# EAGLE design Arduino_shield (EAGLE 7.7.0)
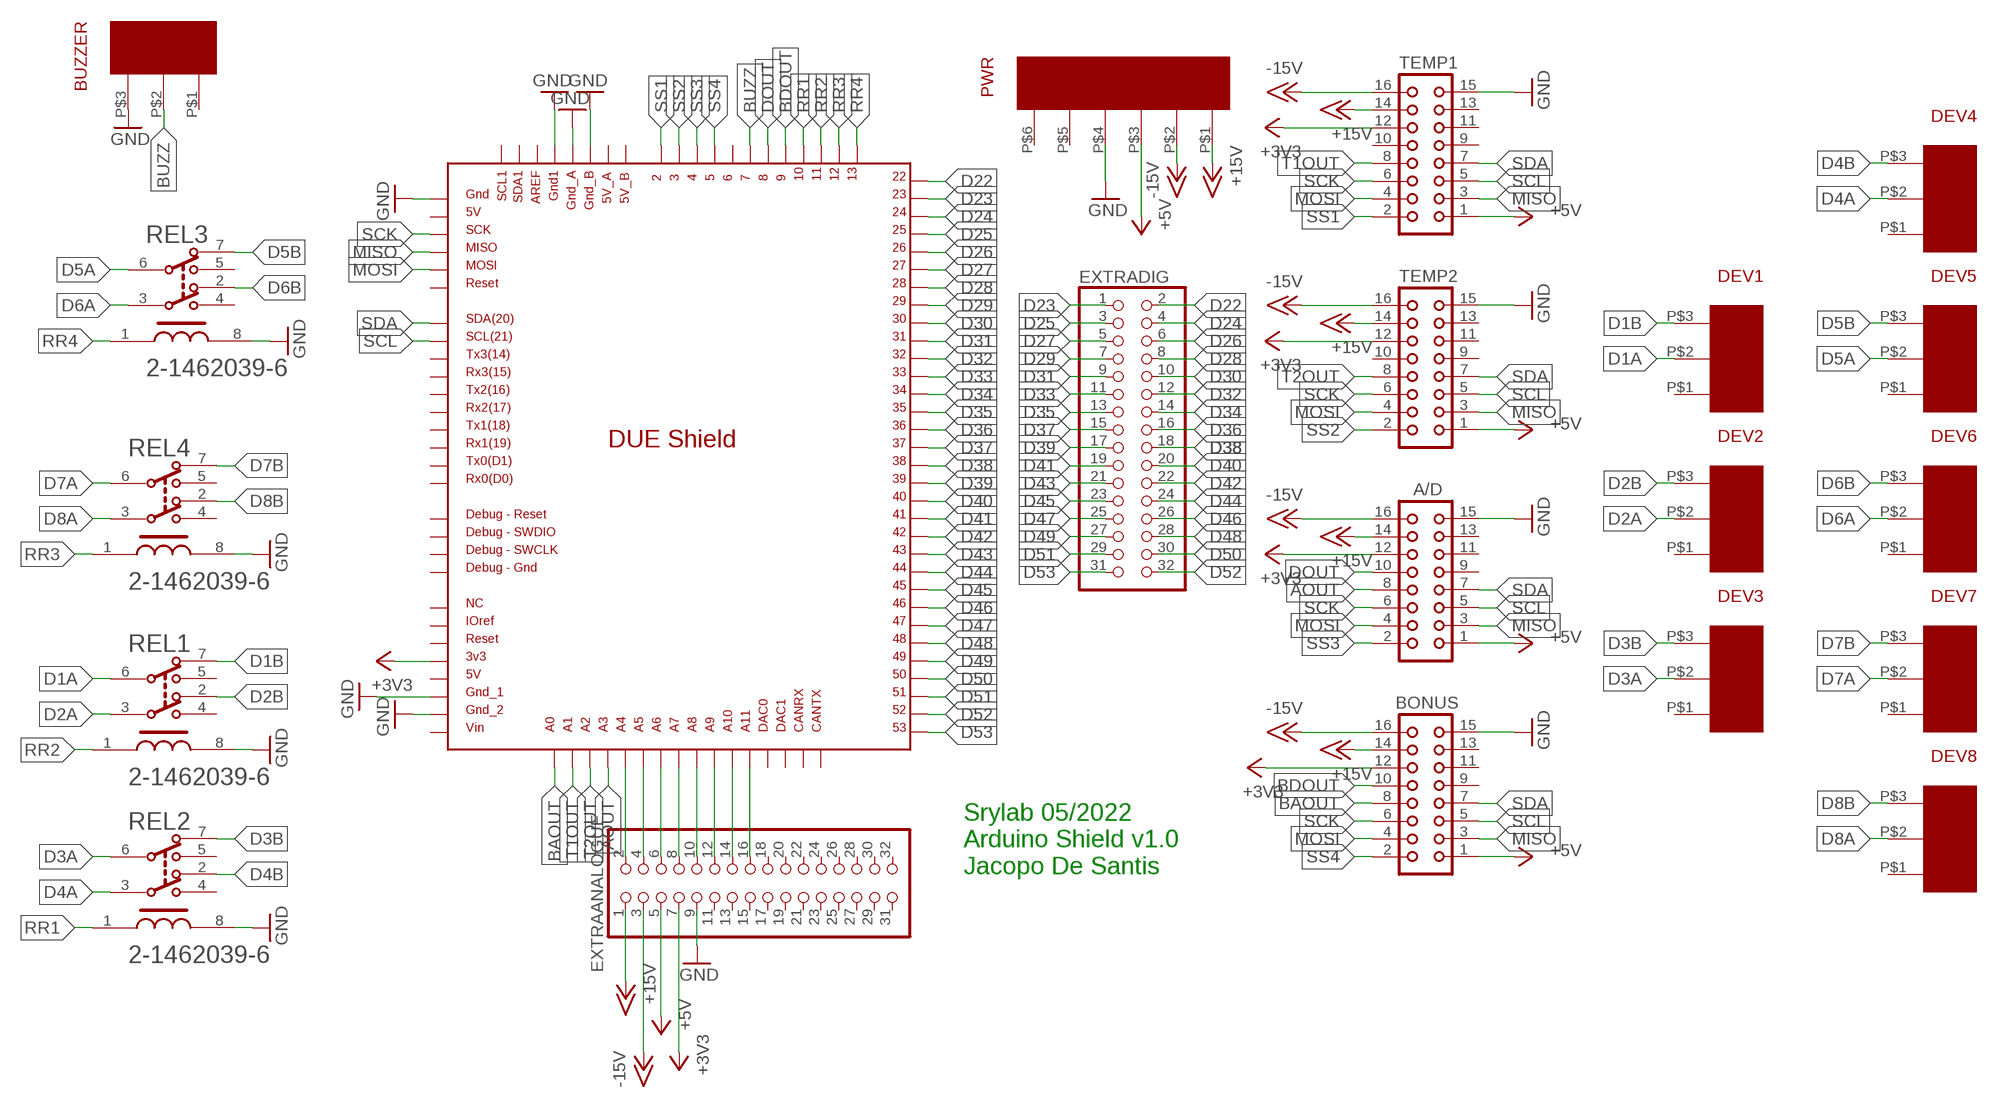
[diagram p0: schematic, sheet 1]

## Parts
A/D  CON16L  [CON16L]
BONUS  CON16L  [CON16L]
BUZZER  3PIN_CON  [3PIN_CON]
DEV1  3PIN_CON  [3PIN_CON]
DEV2  3PIN_CON  [3PIN_CON]
DEV3  3PIN_CON  [3PIN_CON]
DEV4  3PIN_CON  [3PIN_CON]
DEV5  3PIN_CON  [3PIN_CON]
DEV6  3PIN_CON  [3PIN_CON]
DEV7  3PIN_CON  [3PIN_CON]
DEV8  3PIN_CON  [3PIN_CON]
EXTRAANALOGUE  PINHD-2X16  [2X16]
EXTRADIG  PINHD-2X16  [2X16]
PWR  6PIN_CON  [6PIN_CON]
REL1  TE_2-1462039-6TE_2-1462039-6_0_0  [TE_2-1462039-6_0]
REL2  TE_2-1462039-6TE_2-1462039-6_0_0  [TE_2-1462039-6_0]
REL3  TE_2-1462039-6TE_2-1462039-6_0_0  [TE_2-1462039-6_0]
REL4  TE_2-1462039-6TE_2-1462039-6_0_0  [TE_2-1462039-6_0]
TEMP1  CON16L  [CON16L]
TEMP2  CON16L  [CON16L]
U$1  DUE(NORMAL)  [DUE(NORMAL)]

## Nets
+3V3: A/D.12 BONUS.12 EXTRAANALOGUE.7 TEMP1.12 TEMP2.12 U$1.3V3
+5V: A/D.1 BONUS.1 EXTRAANALOGUE.5 PWR.P$3 TEMP1.1 TEMP2.1
+15V: A/D.14 BONUS.14 EXTRAANALOGUE.1 PWR.P$1 TEMP1.14 TEMP2.14
-15V: A/D.16 BONUS.16 EXTRAANALOGUE.3 PWR.P$2 TEMP1.16 TEMP2.16
AOUT: A/D.8 U$1.A3
BAOUT: BONUS.8 U$1.A0
BDOUT: BONUS.10 U$1.9
BUZZ: BUZZER.P$2 U$1.7
D1A: DEV1.P$2 REL1.6
D1B: DEV1.P$3 REL1.7
D2A: DEV2.P$2 REL1.3
D2B: DEV2.P$3 REL1.2
D3A: DEV3.P$2 REL2.6
D3B: DEV3.P$3 REL2.7
D4A: DEV4.P$2 REL2.3
D4B: DEV4.P$3 REL2.2
D5A: DEV5.P$2 REL3.6
D5B: DEV5.P$3 REL3.7
D6A: DEV6.P$2 REL3.3
D6B: DEV6.P$3 REL3.2
D7A: DEV7.P$2 REL4.6
D7B: DEV7.P$3 REL4.7
D8A: DEV8.P$2 REL4.3
D8B: DEV8.P$3 REL4.2
D22: EXTRADIG.2 U$1.22
D23: EXTRADIG.1 U$1.23
D24: EXTRADIG.4 U$1.24
D25: EXTRADIG.3 U$1.25
D26: EXTRADIG.6 U$1.26
D27: EXTRADIG.5 U$1.27
D28: EXTRADIG.8 U$1.28
D29: EXTRADIG.7 U$1.29
D30: EXTRADIG.10 U$1.30
D31: EXTRADIG.9 U$1.31
D32: EXTRADIG.12 U$1.32
D33: EXTRADIG.11 U$1.33
D34: EXTRADIG.14 U$1.34
D35: EXTRADIG.13 U$1.35
D36: EXTRADIG.16 U$1.36
D37: EXTRADIG.15 U$1.37
D38: EXTRADIG.18 U$1.38
D39: EXTRADIG.17 U$1.39
D40: EXTRADIG.20 U$1.40
D41: EXTRADIG.19 U$1.41
D42: EXTRADIG.22 U$1.42
D43: EXTRADIG.21 U$1.43
D44: EXTRADIG.24 U$1.44
D45: EXTRADIG.23 U$1.45
D46: EXTRADIG.26 U$1.46
D47: EXTRADIG.25 U$1.47
D48: EXTRADIG.28 U$1.48
D49: EXTRADIG.27 U$1.49
D50: EXTRADIG.30 U$1.50
D51: EXTRADIG.29 U$1.51
D52: EXTRADIG.32 U$1.52
D53: EXTRADIG.31 U$1.53
DOUT: A/D.10 U$1.8
GND: A/D.15 BONUS.15 BUZZER.P$3 EXTRAANALOGUE.9 PWR.P$4 REL1.8 REL2.8 REL3.8 REL4.8 TEMP1.15 TEMP2.15 U$1.5V_ICSP U$1.GND1 U$1.GND_1 U$1.GND_2 U$1.GND_A U$1.GND_B
MISO: A/D.3 BONUS.3 TEMP1.3 TEMP2.3 U$1.MISO_ICSP
MOSI: A/D.4 BONUS.4 TEMP1.4 TEMP2.4 U$1.MOSI_ICSP
N$57: EXTRAANALOGUE.2 U$1.A4
N$58: EXTRAANALOGUE.4 U$1.A5
N$59: EXTRAANALOGUE.6 U$1.A6
N$60: EXTRAANALOGUE.8 U$1.A7
N$61: EXTRAANALOGUE.10 U$1.A8
N$62: EXTRAANALOGUE.12 U$1.A9
N$63: EXTRAANALOGUE.14 U$1.A10
N$64: EXTRAANALOGUE.16 U$1.A11
RR1: REL2.1 U$1.10
RR2: REL1.1 U$1.11
RR3: REL4.1 U$1.12
RR4: REL3.1 U$1.13
SCK: A/D.6 BONUS.6 TEMP1.6 TEMP2.6 U$1.SCK_ICSP
SCL: A/D.5 BONUS.5 TEMP1.5 TEMP2.5 U$1.SCL
SDA: A/D.7 BONUS.7 TEMP1.7 TEMP2.7 U$1.SDA
SS1: TEMP1.2 U$1.2
SS2: TEMP2.2 U$1.3
SS3: A/D.2 U$1.4
SS4: BONUS.2 U$1.5
T1OUT: TEMP1.8 U$1.A1
T2OUT: TEMP2.8 U$1.A2
Unconnected: A/D.9 A/D.11 A/D.13 BONUS.9 BONUS.11 BONUS.13 BUZZER.P$1 DEV1.P$1 DEV2.P$1 DEV3.P$1 DEV4.P$1 DEV5.P$1 DEV6.P$1 DEV7.P$1 DEV8.P$1 EXTRAANALOGUE.11 EXTRAANALOGUE.13 EXTRAANALOGUE.15 EXTRAANALOGUE.17 EXTRAANALOGUE.18 EXTRAANALOGUE.19 EXTRAANALOGUE.20 EXTRAANALOGUE.21 EXTRAANALOGUE.22 EXTRAANALOGUE.23 EXTRAANALOGUE.24 EXTRAANALOGUE.25 EXTRAANALOGUE.26 EXTRAANALOGUE.27 EXTRAANALOGUE.28 EXTRAANALOGUE.29 EXTRAANALOGUE.30 EXTRAANALOGUE.31 EXTRAANALOGUE.32 PWR.P$5 PWR.P$6 REL1.4 REL1.5 REL2.4 REL2.5 REL3.4 REL3.5 REL4.4 REL4.5 TEMP1.9 TEMP1.10 TEMP1.11 TEMP1.13 TEMP2.9 TEMP2.10 TEMP2.11 TEMP2.13 U$1.5V U$1.5V_A U$1.5V_B U$1.6 U$1.AREF U$1.CANRX U$1.CANTX U$1.DAC0 U$1.DAC1 U$1.GND_DEBUG U$1.GND_ICSP U$1.IOREF U$1.NC U$1.RESET U$1.RESET_DEBUG U$1.RESET_ICSP U$1.RX0 U$1.RX1 U$1.RX2 U$1.RX3 U$1.SCL1 U$1.SDA1 U$1.SWCLK_DEBUG U$1.SWDIO_DEBUG U$1.TX0 U$1.TX1 U$1.TX2 U$1.TX3 U$1.VIN

## Notes on the sheet
- Srylab 05/2022
  Arduino Shield v1.0
  Jacopo De Santis

## Library data of the parts
A/D BONUS TEMP1 TEMP2 = con-harting:CON16L: CONNECTOR; OC_FARNELL: unknown; OC_NEWARK: unknown
BUZZER DEV1-DEV8 = CoilCircuitLibrary_E7:3PIN_CON
EXTRAANALOGUE EXTRADIG = pinhead:PINHD-2X16: PIN HEADER
PWR = CoilCircuitLibrary_E7:6PIN_CON
REL1-REL4 = TE - 2-1462039-6:TE_2-1462039-6: Electromechanical Relay DPDT 2A 3VDC 180Ohm Surface Mount; AMBIENT_TEMPERATURE_RANGE_HIGH: +85°C; AMBIENT_TEMPERATURE_RANGE_LOW: -40°C; AUTOMOTIVE: No; CENTROID_NOT_SPECIFIED: No; COIL_POWER: 50mW; COIL_RESISTANCE: 180Ω; COIL_TYPE: Non-Latching; COIL_VOLTAGE: 3V; CURRENT_RATING: 2A; DATASHEET: https://www.te.com/usa-en/product-2-1462039-6.html?te_bu=Cor&te_type=other&te_campaign=oct_glo_cor-oct-global-oth-prtnr-fy19-oct-octo-buy-bom_sma-298_2&elqCampaignId=35216; DEVICE_CLASS_L1: Electromechanical; DEVICE_CLASS_L2: Relays; DEVICE_CLASS_L3: Signal Relays; DIGIKEY_DESCRIPTION: RELAY TELECOM DPDT 2A 3VDC; DIGIKEY_PART_NUMBER: PB1163CT-ND; FOOTPRINT_VARIANT_NAME_0: Recommended_Land_Pattern; HEIGHT: 5.65mm; LEAD_FREE: Yes; MF: TE; MFG_PACKAGE_IDENT: 2-1462039-6; MFG_PACKAGE_IDENT_DATE: 0; MFG_PACKAGE_IDENT_REV: 0; MOUSER_PART_NUMBER: 655-IM21GR; MPN: 2-1462039-6; NUMBER_OF_CONTACTS: 2; PACKAGE: SMT_RELAY; PREFIX: K; ROHS: Yes; STANDOFF_HEIGHT: 0.25mm; SWITCHING_CURRENT: 2A; SWITCHING_POWER: 60W; TEMPERATURE_RANGE_HIGH: +85°C; TEMPERATURE_RANGE_LOW: -40°C; THROW_CONFIGURATION: DPDT; VERIFICATION_VERSION: 0.0.0.3
U$1 = DUElib130425:DUE(NORMAL)

## Board
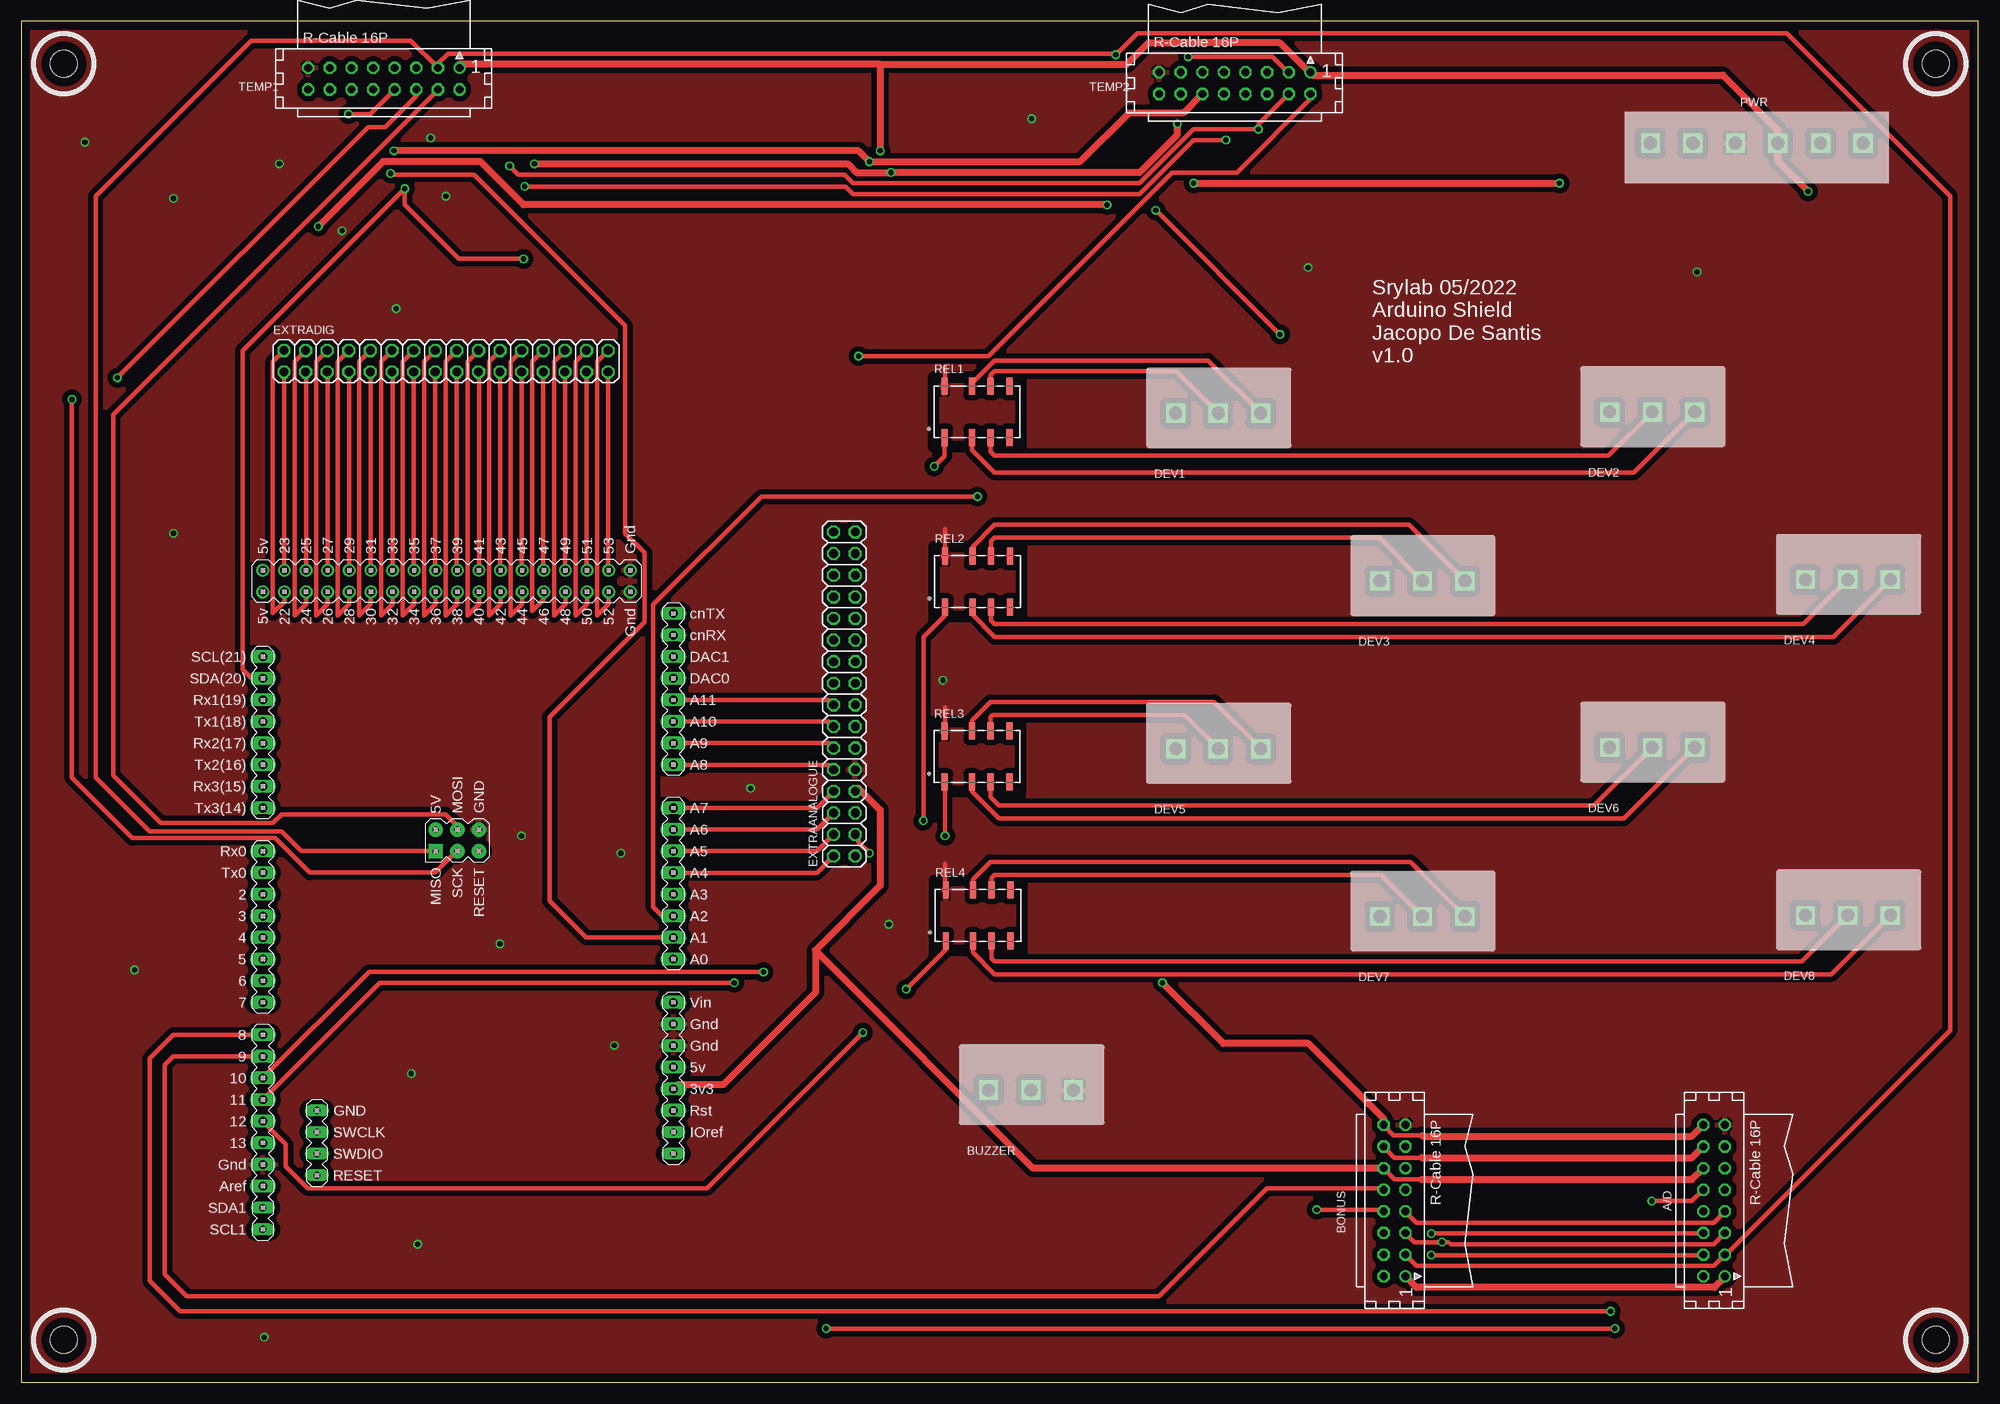
[diagram p1: board, top side]
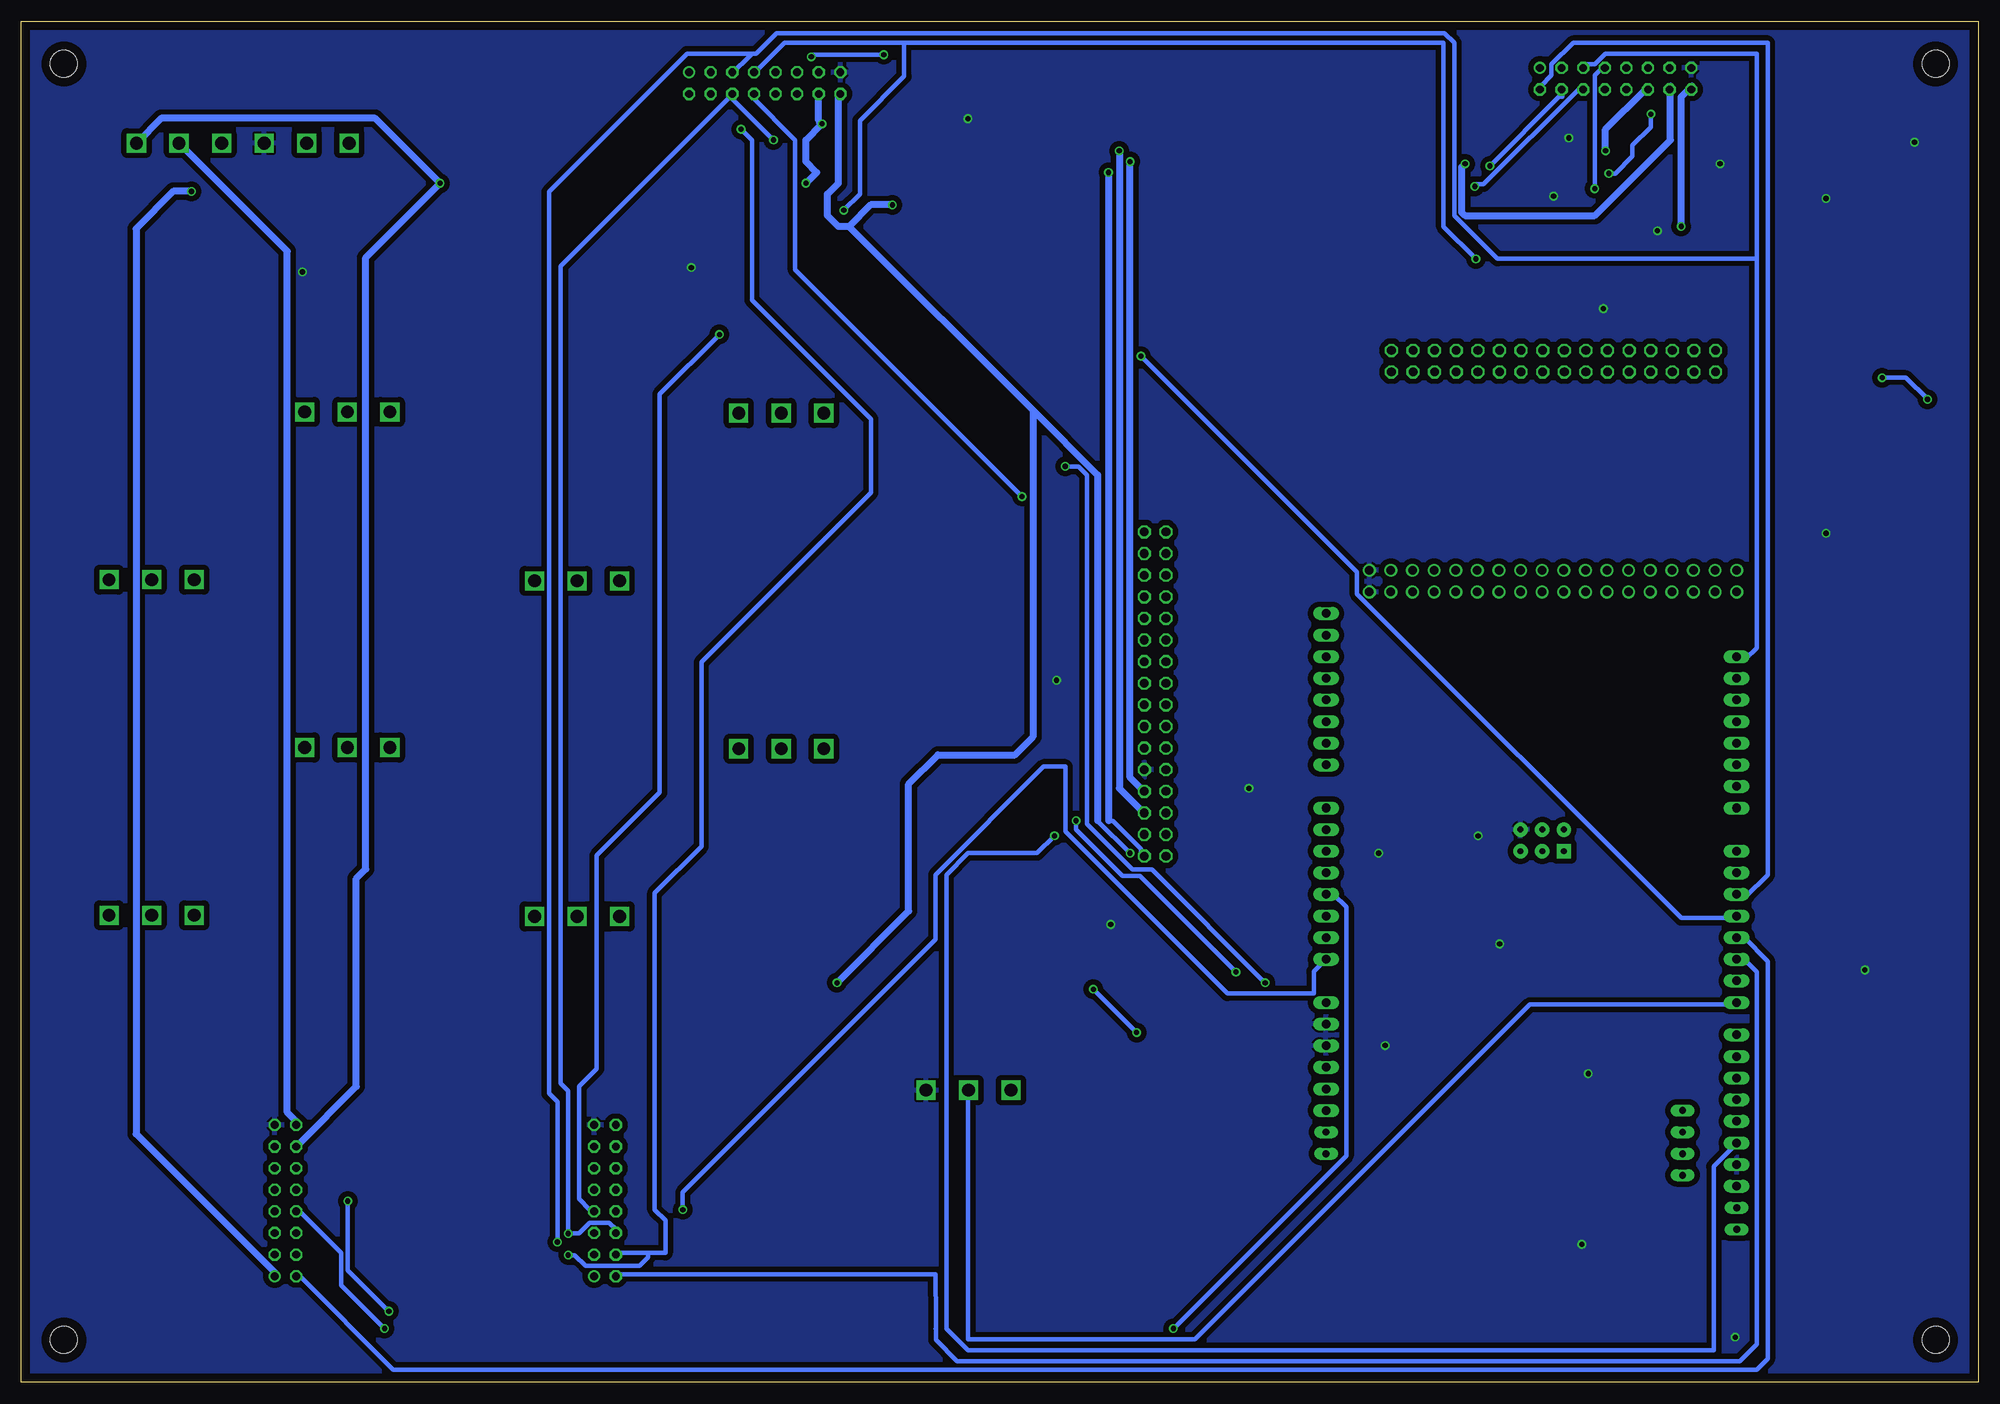
[diagram p2: board, bottom side, seen from below]

Size 230 x 160 mm. Coordinates in mm from the lower left corner, seen from the top.
Outline: 0,0 230,0 230,160 0,160 0,0
Copper layers (1*16): Top 0.035mm / dielectric 1.5mm / Bottom 0.035mm
Design rules "default *": minimum track width 10mil, minimum drill 24mil, track to track 6mil, track to pad 6mil, pad to pad 6mil, via to via 6mil, smd to smd 6mil, copper to edge 40mil, drill to drill 8mil, minimum pad ring 10mil, minimum via ring 8mil, stop-mask expansion 4mil, vias tented up to drill 0mil, thermal gap 10mil
Holes 3.2 mm at 5,5 5,155 225,155 225,5

### Footprints (pad centres in the part's own frame; a part is rotated, then mirrored left to right if it is on the bottom)
CON16L = drill 0.914: 1 8.89,1.27 | drill 0.914 octagon: 2 8.89,-1.27; 3 6.35,1.27; 4 6.35,-1.27; 5 3.81,1.27; 6 3.81,-1.27; 7 1.27,1.27; 8 1.27,-1.27; 9 -1.27,1.27; 10 -1.27,-1.27; 11 -3.81,1.27; 12 -3.81,-1.27; 13 -6.35,1.27; 14 -6.35,-1.27; 15 -8.89,1.27; 16 -8.89,-1.27
3PIN_CON = drill 1.5 square: P$1 0,0; P$2 5,0; P$3 10,0
2X16 = drill 1.016 octagon: 1 -19.05,-1.27; 2 -19.05,1.27; 3 -16.51,-1.27; 4 -16.51,1.27; 5 -13.97,-1.27; 6 -13.97,1.27; 7 -11.43,-1.27; 8 -11.43,1.27; 9 -8.89,-1.27; 10 -8.89,1.27; 11 -6.35,-1.27; 12 -6.35,1.27; 13 -3.81,-1.27; 14 -3.81,1.27; 15 -1.27,-1.27; 16 -1.27,1.27; 17 1.27,-1.27; 18 1.27,1.27; 19 3.81,-1.27; 20 3.81,1.27; 21 6.35,-1.27; 22 6.35,1.27; 23 8.89,-1.27; 24 8.89,1.27; 25 11.43,-1.27; 26 11.43,1.27; 27 13.97,-1.27; 28 13.97,1.27; 29 16.51,-1.27; 30 16.51,1.27; 31 19.05,-1.27; 32 19.05,1.27
6PIN_CON = drill 1.5 square: P$1 0,0; P$2 5,0; P$3 10,0; P$4 15,0; P$5 20,0; P$6 25,0
TE_2-1462039-6_0 = smd 0.7 x 2: 1 -3.8,-3; 2 -0.6,-3; 3 1.6,-3; 4 3.8,-3; 5 3.8,3; 6 1.6,3; 7 -0.6,3; 8 -3.8,3
DUE(NORMAL) = drill 1 long: 2 -16.51,30.48; 3 -19.05,30.48; 3V3 -39.37,-17.78; 4 -21.59,30.48; 5 -24.13,30.48; 5V -36.83,-17.78; 6 -26.67,30.48; 7 -29.21,30.48; 8 -33.02,30.48; 9 -35.56,30.48; 10 -38.1,30.48; 11 -40.64,30.48; 12 -43.18,30.48; 13 -45.72,30.48; A0 -24.13,-17.78; A1 -21.59,-17.78; A2 -19.05,-17.78; A3 -16.51,-17.78; A4 -13.97,-17.78; A5 -11.43,-17.78; A6 -8.89,-17.78; A7 -6.35,-17.78; A8 -1.27,-17.78; A9 1.27,-17.78; A10 3.81,-17.78; A11 6.35,-17.78; AREF -50.8,30.48; AREF1 -50.8,30.48; CANRX 13.97,-17.78; CANTX 16.51,-17.78; DAC0 8.89,-17.78; DAC1 11.43,-17.78; GND1 -48.26,30.48; GND_1 -34.29,-17.78; GND_2 -31.75,-17.78; RESET -41.91,-17.78; RX0 -11.43,30.48; RX1 6.35,30.48; RX2 1.27,30.48; RX3 -3.81,30.48; SCL 11.43,30.48; SDA 8.89,30.48; TX0 -13.97,30.48; TX1 3.81,30.48; TX2 -1.27,30.48; TX3 -6.35,30.48; VIN -29.21,-17.78 | drill 1: 5V_A 19.05,30.48; 5V_B 21.59,30.48; 22 19.05,27.94; 23 21.59,27.94; 24 19.05,25.4; 25 21.59,25.4; 26 19.05,22.86; 27 21.59,22.86; 28 19.05,20.32; 29 21.59,20.32; 30 19.05,17.78; 31 21.59,17.78; 32 19.05,15.24; 33 21.59,15.24; 34 19.05,12.7; 35 21.59,12.7; 36 19.05,10.16; 37 21.59,10.16; 38 19.05,7.62; 39 21.59,7.62; 40 19.05,5.08; 41 21.59,5.08; 42 19.05,2.54; 43 21.59,2.54; 44 19.05,0; 45 21.59,0; 46 19.05,-2.54; 47 21.59,-2.54; 48 19.05,-5.08; 49 21.59,-5.08; 50 19.05,-7.62; 51 21.59,-7.62; 52 19.05,-10.16; 53 21.59,-10.16; GND_A 19.05,-12.7; GND_B 21.59,-12.7 | drill 0.7 pad 1.676: 5V_ICSP -8.89,5.08; GND_ICSP -8.89,10.16; MOSI_ICSP -8.89,7.62; RESET_ICSP -11.43,5.08; SCK_ICSP -11.43,7.62 | drill 0.8 pad 1.422 long: GND_DEBUG -41.91,24.13; IOREF -44.45,-17.78; NC -46.99,-17.78; RESET_DEBUG -49.53,24.13; SCL1 -55.88,30.48; SDA1 -53.34,30.48; SWCLK_DEBUG -44.45,24.13; SWDIO_DEBUG -46.99,24.13 | drill 0.7 pad 1.676 square: MISO_ICSP -11.43,10.16

### Placement (x,y rotation side)
A/D  198.95,21.38 270 top
BONUS  161.39,21.38 270 top
BUZZER  113.68,34.36 0 top
DEV1  135.68,113.94 0 top
DEV2  186.68,114.08 0 top
DEV3  159.68,94.22 0 top
DEV4  209.68,94.36 0 top
DEV5  135.68,74.5 0 top
DEV6  186.68,74.64 0 top
DEV7  159.68,54.78 0 top
DEV8  209.68,54.92 0 top
EXTRAANALOGUE  96.74,80.92 90 top
EXTRADIG  49.92,120.04 0 top
PWR  216.46,145.68 180 top
REL1  112.33,114.09 0 top
REL2  112.39,94.14 0 top
REL3  112.32,73.57 0 top
REL4  112.46,54.9 0 top
TEMP1  42.62,153.25 0 top
TEMP2  142.62,152.73 0 top
U$1  58.87,73.88 90 top

### Tracks (layer width: path | path; a pad name or v marks a point on that pad's centre or on a via)
+3V3  (via drill 0.61)
  Top 0.254: BONUS.12 160.12,25.15
  Top 0.508: 160.12,25.15 161.4,23.87 164.58,23.87
  Top 0.813: 164.58,23.87 196.36,23.87 A/D.12 | v43.8,144.77 98.41,144.77 v99.68,143.5 124.44,143.5 130.16,149.22 136.56,149.22 TEMP2.12 | 93.33,50.79 100.95,58.41 100.95,67.3 98.41,69.84 EXTRAANALOGUE.7 | 93.33,50.79 118.93,25.19 BONUS.12 | 93.33,50.79 93.33,45.83 82.5,35 77.14,35 U$1.3V3
  Bottom 0.813: v99.68,143.5 99.68,71.11 98.41,69.84 EXTRAANALOGUE.7 | v43.8,144.77 43.8,147.31 39.13,151.98 TEMP1.12
+5V  (via drill 0.61)
  Top 0.254: 151.75,153.66 TEMP2.1
  Top 0.813: A/D.1 200.22,12.39 198.99,11.17 163.98,11.17 BONUS.1 | 100.95,154.93 51.42,154.93 TEMP1.1 | 100.95,154.93 v100.95,144.77 | v210,140 206.46,143.54 PWR.P$3 206.46,147.2 200,153.66 151.75,153.66 147.94,157.47 135.24,157.47 135.21,157.5 132.5,157.5 129.93,154.93 100.95,154.93
  Bottom 0.254: 200.01,12.69 A/D.1
  Bottom 0.813: v100.95,144.77 100.95,69.84 98.41,67.3 EXTRAANALOGUE.5 | 200.01,12.69 216.52,29.2 216.52,135.62 212.14,140 v210,140
+15V  (via drill 0.61)
  Top 0.254: BONUS.14 160.12,27.69
  Top 0.508: 160.12,27.69 161.4,26.41 164.58,26.41
  Top 0.813: 164.58,26.41 196.36,26.41 A/D.14 | v137.78,140.96 v180.79,140.96 | v135.88,147.94 135.88,146.68 131.43,142.23 v102.22,142.23 98.16,142.23 97.14,143.25 v60.31,143.25
  Bottom 0.254: A/D.14 197.47,27.93 197.47,27.95 | 36.18,152.39 TEMP1.14
  Bottom 0.508: 102.22,66.03 101.71,66.03 98.41,62.73 98.41,62.27 EXTRAANALOGUE.1
  Bottom 0.813: 36.18,152.39 36.18,146.04 45.07,137.15 60.31,137.15 60.69,137.53 60.69,142.87 v60.31,143.25 | v102.22,142.23 102.22,66.03 | v137.78,140.96 136.51,142.23 137.78,143.5 137.78,146.04 v135.88,147.94 136.27,148.34 TEMP2.14 | PWR.P$1 213.56,148.58 188.41,148.58 v180.79,140.96 189.51,132.24 189.51,60.34 190.61,59.24 190.61,34.8 197.47,27.95
-15V  (via drill 0.61)
  Top 0.508: v99.68,62.22 98.41,63.49 98.41,64.01 EXTRAANALOGUE.3 | 164.63,29.02 164.58,29.07 161.28,29.07 160.12,30.23 BONUS.16
  Top 0.813: A/D.16 196.36,28.95 164.7,28.95 164.63,29.02 | v34.91,135.88 42.53,143.5 53.96,143.5 59.04,138.42 v127.62,138.42 | v134.13,46.98 141.26,39.85 151.26,39.85 160.12,30.99 BONUS.16
  Bottom 0.254: 197.47,30.47 A/D.16 | 33.64,152.39 TEMP1.16
  Bottom 0.508: 103.49,66.03 v99.68,62.22
  Bottom 0.813: 197.47,30.47 198.74,31.74 198.74,132.96 PWR.P$2 | 33.64,152.39 34.91,151.12 v34.91,135.88 | 103.49,66.03 103.49,106.67 111.11,114.29 | 132.7,135.88 111.11,114.29 | 111.11,114.29 111.11,75.88 113.21,73.78 122.26,73.78 125.71,70.33 125.71,55.4 v134.13,46.98 | v127.62,138.42 130.16,138.42 132.7,135.88 | 132.7,135.88 133.97,135.88 135.24,137.15 135.24,139.69 133.97,140.96 133.97,151.22 TEMP2.16
AOUT  (via drill 0.61)
  Top 0.508: v94.6,6.34 v187.31,6.34
  Bottom 0.508: v187.31,6.34 192.39,11.42 192.39,15.23 197.47,20.31 A/D.8 | v94.6,6.34 74.28,26.66 74.28,55.87 75.78,57.37 U$1.A3
BAOUT  (via drill 0.61)
  Top 0.508: v152.26,20.31 160.64,20.31 BONUS.8
  Bottom 0.508: v152.26,20.31 152.26,22.34 122.54,52.06 122.54,59.68 109.84,72.38 107.3,72.38 107.3,64.76 88.25,45.71 78.09,45.71 78.09,48.31 U$1.A0
BDOUT
  Top 0.508: U$1.9 17.87,38.32 16.88,37.33 16.88,12.69 19.42,10.15 133.72,10.15 146.42,22.85 159.92,22.85 BONUS.10
BUZZ
  Bottom 0.254: 118.73,34.28 BUZZER.P$2
  Bottom 0.508: 118.73,34.28 118.73,5.07 92.06,5.07 52.69,44.44 28.56,44.44 U$1.7
D1A
  Top 0.508: REL1.6 113.93,118.38 114.41,118.86 135.76,118.86 DEV1.P$2
D1B
  Top 0.508: REL1.7 111.73,117.45 114.41,120.13 139.49,120.13 DEV1.P$3
D2A
  Top 0.508: REL1.3 113.93,109.44 114.41,108.96 186.56,108.96 DEV2.P$2
D2B
  Top 0.508: REL1.2 111.73,109.61 114.41,106.92 189.52,106.92 DEV2.P$3
D3A
  Top 0.508: REL2.6 113.99,98.88 114.41,99.3 159.6,99.3 DEV3.P$2
D3B
  Top 0.508: REL2.7 111.79,98.21 114.41,100.83 163.07,100.83 DEV3.P$3
D4A
  Top 0.508: REL2.3 113.99,89.57 114.41,89.14 209.46,89.14 DEV4.P$2
D4B
  Top 0.508: REL2.2 111.79,90.24 114.41,87.62 212.94,87.62 DEV4.P$3
D5A
  Top 0.508: REL3.6 113.92,78.24 114.16,78.48 136.7,78.48 DEV5.P$2
D5B
  Top 0.508: REL3.7 111.72,77.82 113.9,80 140.18,80 DEV5.P$3
D6A
  Top 0.508: REL3.3 113.92,68.81 114.92,67.81 184.85,67.81 DEV6.P$2
D6B
  Top 0.508: REL3.2 111.72,69.48 114.92,66.28 188.32,66.28 DEV6.P$3
D7A
  Top 0.508: REL4.6 114.06,59.32 114.41,59.68 159.78,59.68 DEV7.P$2
D7B
  Top 0.508: REL4.7 111.86,59.16 113.9,61.2 163.26,61.2 DEV7.P$3
D8A
  Top 0.508: REL4.3 114.06,49.88 114.41,49.52 209.28,49.52 DEV8.P$2
D8B
  Top 0.508: REL4.2 111.86,50.55 114.41,48 212.76,48 DEV8.P$3
D22
  Top 0.508: U$1.22 30.93,91.77 29.58,90.41 29.58,120.02 EXTRADIG.2
D23
  Top 0.508: EXTRADIG.1 30.87,95.53 U$1.23
D24
  Top 0.508: U$1.24 33.47,91.51 32.12,90.16 32.12,120.02 EXTRADIG.4
D25
  Top 0.254: 33.47,118.71 EXTRADIG.3
  Top 0.508: U$1.25 33.47,118.71
D26
  Top 0.508: U$1.26 36.01,91.51 34.66,90.16 34.66,120.02 EXTRADIG.6
D27
  Top 0.254: 36.01,118.71 EXTRADIG.5
  Top 0.508: U$1.27 36.01,118.71
D28
  Top 0.508: U$1.28 38.55,91.51 37.2,90.16 37.2,120.02 EXTRADIG.8
D29
  Top 0.254: 38.55,118.71 EXTRADIG.7
  Top 0.508: U$1.29 38.55,118.71
D30
  Top 0.508: U$1.30 41.09,91.51 39.74,90.16 39.74,120.02 EXTRADIG.10
D31
  Top 0.254: 41.09,118.71 EXTRADIG.9
  Top 0.508: U$1.31 41.09,118.71
D32
  Top 0.508: U$1.32 43.63,91.51 42.28,90.16 42.28,120.02 EXTRADIG.12
D33
  Top 0.254: 43.63,118.71 EXTRADIG.11
  Top 0.508: U$1.33 43.63,118.71
D34
  Top 0.508: U$1.34 46.17,91.51 44.82,90.16 44.82,120.02 EXTRADIG.14
D35
  Top 0.508: EXTRADIG.13 46.11,95.53 U$1.35
D36
  Top 0.508: U$1.36 48.71,91.51 47.36,90.16 47.36,120.02 EXTRADIG.16
D37
  Top 0.508: EXTRADIG.15 48.65,95.53 U$1.37
D38
  Top 0.508: U$1.38 51.25,91.51 49.9,90.16 49.9,120.02 EXTRADIG.18
D39
  Top 0.508: EXTRADIG.17 51.19,95.53 U$1.39
D40
  Top 0.508: U$1.40 53.79,91.51 52.44,90.16 52.44,120.02 EXTRADIG.20
D41
  Top 0.254: 53.79,118.71 EXTRADIG.19
  Top 0.508: U$1.41 53.79,118.71
D42
  Top 0.508: U$1.42 56.33,91.51 54.98,90.16 54.98,120.02 EXTRADIG.22
D43
  Top 0.508: EXTRADIG.21 56.27,95.53 U$1.43
D44
  Top 0.508: U$1.44 58.87,91.51 57.52,90.16 57.52,120.02 EXTRADIG.24
D45
  Top 0.508: EXTRADIG.23 58.81,95.53 U$1.45
D46
  Top 0.508: U$1.46 61.41,92.02 60.06,90.67 60.06,120.02 EXTRADIG.26
D47
  Top 0.508: EXTRADIG.25 61.35,95.53 U$1.47
D48
  Top 0.508: U$1.48 63.95,91.51 62.6,90.16 62.6,120.02 EXTRADIG.28
D49
  Top 0.508: EXTRADIG.27 63.89,95.53 U$1.49
D50
  Top 0.508: U$1.50 66.49,91.51 65.14,90.16 65.14,120.02 EXTRADIG.30
D51
  Top 0.508: EXTRADIG.29 66.43,95.53 U$1.51
D52
  Top 0.508: U$1.52 69.03,91.51 67.68,90.16 67.68,120.02 EXTRADIG.32
D53
  Top 0.508: EXTRADIG.31 68.97,95.53 U$1.53
DOUT  (via drill 0.61)
  Top 0.508: U$1.8 17.87,40.86 15.1,38.09 15.1,11.93 18.65,8.37 v186.8,8.37 | v191.63,21.33 196.36,21.33 A/D.10
  Bottom 0.508: v186.8,8.37 191.63,13.2 v191.63,21.33
GND  (via drill 0.61)
  Top 0.508: REL4.8 108.57,57.98 108.57,60.95 | REL3.8 108.57,76.62 108.57,79.36 | REL2.8 108.57,97.16 108.57,100.32 | REL1.8 108.57,117.12 108.57,119.37
  Top 0.61: 108.59,117.09 REL1.8
  other vias: 44.05,126.23 30.34,143.25 37.7,135.37 58.79,64.25 70.47,62.22 69.71,39.61 56.25,51.55 108.32,82.54 85.71,69.84 101.97,53.84 17.89,139.18 7.48,145.79 17.89,99.81 13.32,48.5 45.83,36.31 46.59,16.25 48.12,146.29 49.9,139.44 151.24,131.05 196.96,130.55 28.56,5.32 118.74,148.55
  pour Top (isolate 0.635): -5,165 -5,-5 235,-5 235,165
  pour Bottom (isolate 0.635): -5,165 -5,-5 235,-5 235,165
MISO  (via drill 0.61)
  Top 0.254: 149.21,153.66 TEMP2.3 | 48.88,154.93 TEMP1.3
  Top 0.508: BONUS.3 163.98,13.71 198.9,13.71 A/D.3 200.32,15.03 226.7,41.41 226.7,139.44 207.53,158.61 131.18,158.61 v128.64,156.07 128.51,156.2 50.15,156.2 48.88,154.93 | U$1.MISO_ICSP 32.9,62.45 30.59,64.76 15.1,64.76 8.75,71.11 8.75,139.44 27.04,157.72 45.77,157.72 TEMP1.3 | 149.21,153.66 147.05,155.82 v137.15,155.82
  Bottom 0.508: v128.64,156.07 136.89,156.07 v137.15,155.82
MOSI  (via drill 0.61)
  Top 0.254: 197.63,14.98 A/D.4 | U$1.MOSI_ICSP 51.25,65.44
  Top 0.508: v165.72,14.98 197.63,14.98 | 51.25,65.44 49.9,66.79 30.59,66.79 29.58,65.78 16.37,65.78 10.78,71.36 10.78,113.79 TEMP1.4 | v57.39,142.99 58.41,141.98 96.76,141.98 97.78,140.96 131.43,140.96 137.78,147.31 v145.4,147.31 145.4,147.89 TEMP2.4
  Bottom 0.508: TEMP1.4 48.88,152.39 48.88,151.12 49.26,151.12 v57.39,142.99 | 156.32,15.23 154.29,15.23 154.29,19.04 155.56,20.31 155.56,57.55 150.07,63.03 150.07,84.67 130.15,104.6 130.15,113.26 144.13,127.24 144.13,146.04 v145.4,147.31 | 156.32,15.23 160.64,15.23 BONUS.4 | v165.72,14.98 164.96,14.98 163.69,13.71 157.34,13.71 156.32,14.72 156.32,15.23
N$57
  Top 0.508: U$1.A4 93.51,59.91 EXTRAANALOGUE.2
N$58
  Top 0.508: U$1.A5 93.51,62.45 EXTRAANALOGUE.4
N$59
  Top 0.508: U$1.A6 93.51,64.99 EXTRAANALOGUE.6
N$60
  Top 0.508: U$1.A7 93.51,67.53 EXTRAANALOGUE.8
N$61
  Top 0.508: U$1.A8 94.89,72.61 EXTRAANALOGUE.10
N$62
  Top 0.508: U$1.A9 94.89,75.15 EXTRAANALOGUE.12
N$63
  Top 0.508: U$1.A10 94.89,77.69 EXTRAANALOGUE.14
N$64
  Top 0.508: U$1.A11 94.89,80.23 EXTRAANALOGUE.16
RR1  (via drill 0.61)
  Top 0.254: 108.57,91.43 REL2.1 108.57,91.12
  Top 0.508: v106.03,66.03 106.03,87.62 108.57,90.16 108.57,91.12 | v87.23,48.25 40.86,48.25 U$1.10
  Bottom 0.508: v87.23,48.25 98.54,59.55 100.57,59.55 106.03,65.01 v106.03,66.03 106.03,65.78
RR2  (via drill 0.61)
  Top 0.254: 108.57,111.75 REL1.1
  Top 0.508: v107.3,107.69 108.53,108.92 REL1.1 | v83.81,46.98 42.13,46.98 U$1.11
  Bottom 0.508: v107.3,107.69 105.78,107.69 104.76,106.67 104.76,65.65 99.43,60.31 97.14,60.31 v83.81,46.98
RR3  (via drill 0.61)
  Top 0.254: 108.57,52.06 REL4.1
  Top 0.508: v98.92,41.14 80.63,22.85 33.64,22.85 31.1,25.39 31.1,27.99 U$1.12 | v104,46.22 108.66,50.88 REL4.1
  Bottom 0.508: v98.92,41.14 v104,46.22
RR4  (via drill 0.61)
  Top 0.254: 108.57,70.52 REL3.1
  Top 0.508: 108.57,71.11 REL3.1 | v108.57,64.25 108.57,70.52
  Bottom 0.254: 28.56,27.93 U$1.13
  Bottom 0.508: 28.56,27.93 31.1,25.39 31.1,3.8 118.73,3.8 121.27,6.34 121.27,59.68 118.73,62.22 110.6,62.22 v108.57,64.25
SCK  (via drill 0.61)
  Top 0.254: U$1.SCK_ICSP 51.14,62.45
  Top 0.508: v165.72,17.52 197.63,17.52 A/D.6 | 51.14,62.45 48.63,59.93 33.89,59.93 29.83,64 13.07,64 5.95,71.11 v5.95,115.56 | v11.29,118.1 40.75,147.56 42.78,147.56 46.43,151.21 TEMP1.6 | v141.59,146.04 137.78,146.04 131.43,139.69 97.78,139.69 96.89,140.58 v59.17,140.58
  Bottom 0.508: v5.95,115.56 8.49,118.1 v11.29,118.1 | 146.67,151.12 166.6,131.19 166.6,35.14 165.72,34.26 v165.72,17.52 164.45,17.52 163.18,18.79 160.89,18.79 160.12,18.01 BONUS.6 | 146.67,151.12 v141.59,146.04 | 146.67,151.12 TEMP2.6 | TEMP1.6 47,151.98 58.15,140.83 58.91,140.83 v59.17,140.58
SCL  (via drill 0.61)
  Top 0.508: BONUS.5 163.73,16.5 v166.99,16.5 167.75,16.5 168.01,16.25 198.9,16.25 A/D.5
  Bottom 0.254: 146.67,153.66 TEMP2.5
  Bottom 0.508: 26.02,132.07 26.02,86.35 27.29,85.08 28.16,85.08 U$1.SCL | 26.02,132.07 26.02,156.2 43.8,156.2 45.07,154.93 46.34,154.93 TEMP1.5 | 144.13,156.2 146.67,153.66 | 26.02,132.07 56.5,132.07 61.58,137.15 61.58,157.47 62.72,158.61 141.21,158.61 143.62,156.2 144.13,156.2 | 144.13,156.2 151.75,156.2 167.99,139.96 167.99,33.96 166.99,32.96 v166.99,16.5
SDA  (via drill 0.61)
  Top 0.254: BONUS.7 162.66,20.07
  Top 0.508: 162.66,20.07 163.94,18.79 198.9,18.79 A/D.7 | v133.34,137.78 v147.94,123.18 | v59.04,132.07 51.42,132.07 45.07,138.42 v45.07,140.32 26.02,121.28 26.02,83.81 27.29,82.54 28.16,82.54 U$1.SDA
  Bottom 0.254: 144.13,153.66 TEMP2.7
  Bottom 0.508: TEMP1.7 43.8,154.93 45.07,153.66 v45.07,140.32 | 144.13,153.66 140.32,157.47 126.22,157.47 | 126.22,157.47 62.85,157.47 62.85,135.88 v59.04,132.07 | v133.34,137.78 131.43,139.69 131.43,148.33 126.22,153.53 126.22,157.47 | BONUS.7 163.18,20.31 164.45,21.58 164.45,34.8 162.37,36.88 162.37,61.92 154.96,69.33 154.96,116.16 v147.94,123.18
SS1
  Bottom 0.508: TEMP1.2 51.42,152.39 50.15,153.66 50.15,154.93 47.61,157.47 24.75,157.47 24.75,59.68 27.29,57.14 28.16,57.14 U$1.2
SS2  (via drill 0.61)
  Top 0.508: v98.41,120.64 113.65,120.64 135.24,142.23 142.86,142.23 151.75,151.12 TEMP2.2
  Bottom 0.508: v98.41,120.64 73.01,95.24 73.01,92.7 34.91,54.6 28.62,54.6 U$1.3
SS3
  Bottom 0.508: A/D.2 197.47,12.69 186.29,1.51 26.02,1.51 24.75,2.78 24.75,49.52 27.52,52.29 U$1.4
SS4
  Bottom 0.254: 160.64,12.69 BONUS.2
  Bottom 0.508: 160.64,12.69 122.54,12.69 122.5,7.5 122.5,6.34 | 122.54,6.34 122.5,6.34 | 28,2.53 28,2.5 | U$1.5 27.52,49.75 26.02,48.25 26,5 26,4.5 28,2.5 | 122.5,6.34 122.5,5 120,2.5 28,2.5
T1OUT  (via drill 0.61)
  Top 0.254: 76.63,52.31 U$1.A1
  Top 0.508: TEMP1.8 41,149.09 v38.47,149.09 | 76.63,52.31 66.41,52.31 62.09,56.63 62.09,78.22 73.26,89.4 73.26,97.53 70.98,99.81 70.98,124.2 53.2,141.98 43.55,141.98 v43.42,142.1
  Bottom 0.508: v43.42,142.1 42.66,142.1 40.62,144.13 40.62,145.41 38.47,147.56 v38.47,149.09
T2OUT  (via drill 0.61)
  Top 0.508: v112.38,104.13 86.98,104.13 74.28,91.43 74.28,55.87 75.55,54.6 76.42,54.6 U$1.A2
  Bottom 0.508: v112.38,104.13 139.05,130.8 139.05,146.04 144.13,151.12 TEMP2.8

### Text on the board
tPlace: Srylab 05/2022 / Arduino Shield / Jacopo De Santis / v1.0